# EAGLE schematic Soldering Iron V2 (EAGLE 9.3.1)
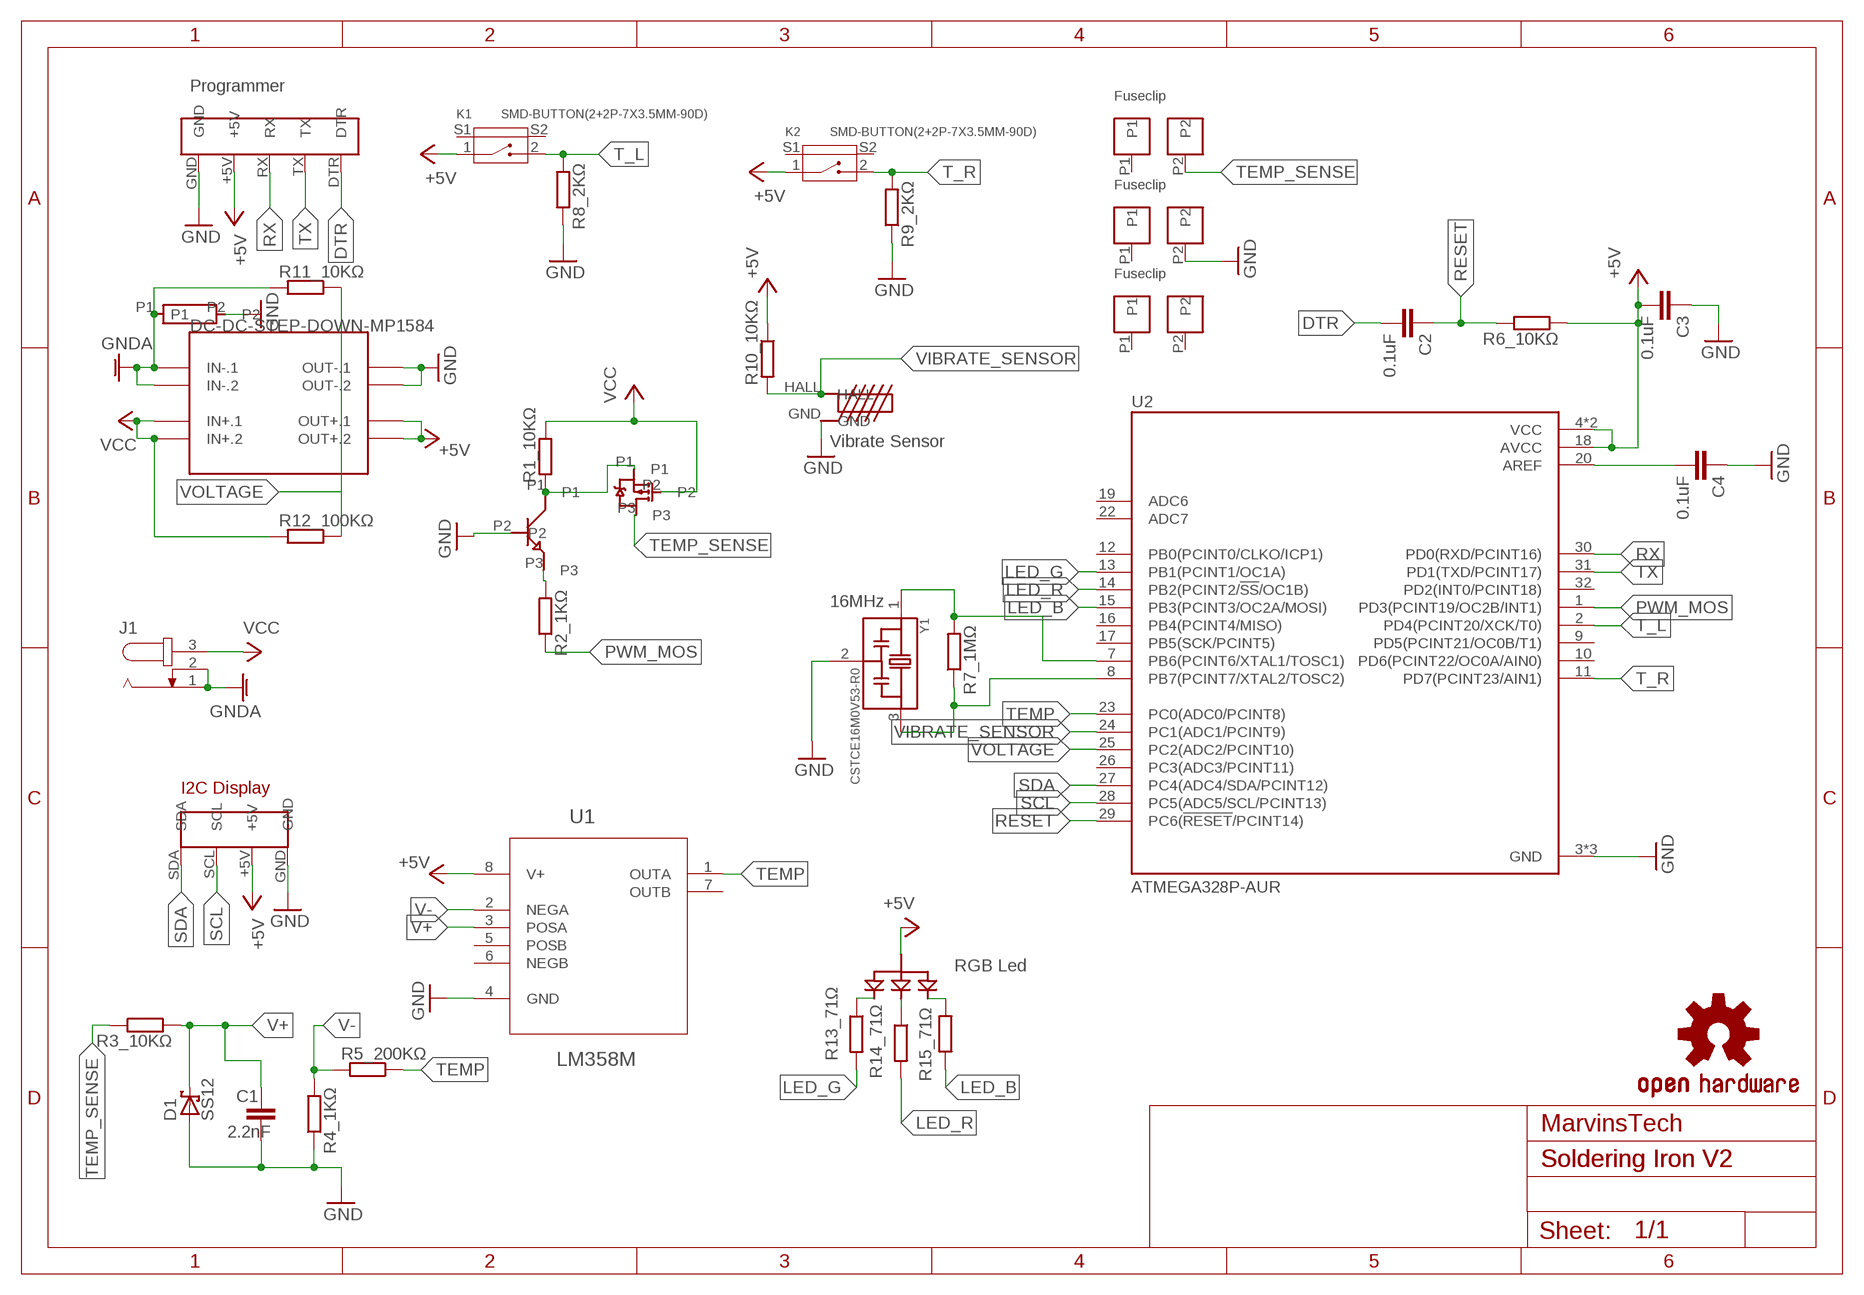
[diagram p0: schematic, sheet 1]

## Parts
C1  2.2nF  2.2NF/2200PF-0603-50V-10%  [0603]
C2  0.1uF  0.1UF-0603-25V-(+80/-20%)  [0603]
C3  0.1uF  0.1UF-0603-25V-(+80/-20%)  [0603]
C4  0.1uF  0.1UF-0603-25V-(+80/-20%)  [0603]
D1  SS12  [DO214AC]
J1  JACK-PLUG0  [SPC4077]
K1  SMD-BUTTON(2+2P-7X3.5MM-90D)  [SW4-SMD-7.0X3.5X3.5MM-90D]
K2  SMD-BUTTON(2+2P-7X3.5MM-90D)  [SW4-SMD-7.0X3.5X3.5MM-90D]
R1_10KΩ  SMK  [SMK]
R2_1KΩ  SMK  [SMK]
R3_10KΩ  SMK  [SMK]
R4_1KΩ  SMK  [SMK]
R5_200KΩ  SMK  [SMK]
R6_10KΩ  SMK  [SMK]
R7_1MΩ  SMK  [SMK]
R8_2KΩ  SMK  [SMK]
R9_2KΩ  SMK  [SMK]
R10_10KΩ  SMK  [SMK]
R11_10KΩ  SMK  [SMK]
R12_100KΩ  SMK  [SMK]
R13_71Ω  SMK  [SMK]
R14_71Ω  SMK  [SMK]
R15_71Ω  SMK  [SMK]
U1  LM358M  [SOIC127P620X175-8N]
U2  ATMEGA328P-AUR  [QFP80P900X900X120-32N]
U$1  DC-DC-STEP-DOWN-MP1584  [DC-DC-STEP-DOWN-MP1584]
U$2  IRF4905STRLPBF  [D2PAK-5]
U$3  2SC3356NPNBJT  [TO236]
U$4  I2C_DISPLAY  [I2C_DISPLAY]
U$5  VIBRATESENSOR  [VIBRATESENSOR]
U$6  FUSECLIPS  [FUSECLIP]
U$7  FUSECLIPS  [FUSECLIP]
U$8  FUSECLIPS  [FUSECLIP]
U$9  SHUNT_RESISTOR1  [RESISTOR1]
U$10  RGBLED  [RGBLED]
U$11  PROGRAMMER  [PROGRAMMER]
U$15  OSHW-LOGOS  [OSHW-LOGO-S]
Y1  CSTCE16M0V53-R0  [OSC_CSTCE16M0V53-R0]

## Nets
+5V: C3.2 K1.1 K2.1 R6_10KΩ.2 R10_10KΩ.1 U1.8(V+) U2.4(VCC) U2.6(VCC) U2.18(AVCC) U$1.OUT+.1 U$1.OUT+.2 U$4.+5V U$10.+5V U$11.+5V
DTR: C2.2 U$11.DTR
GND: C1.2 C3.1 C4.1 D1.A R4_1KΩ.1 R8_2KΩ.1 R9_2KΩ.1 U1.4(GND) U2.3(GND) U2.5(GND) U2.21(GND) U$1.OUT-.1 U$1.OUT-.2 U$3.P2 U$4.GND U$5.GND U$7.P2 U$9.P2 U$11.GND Y1.2
GNDA: J1.1 J1.2 R11_10KΩ.2 U$1.IN-.1 U$1.IN-.2 U$9.P1
LED_B: R15_71Ω.1 U2.15(PB3(PCINT3/OC2A/MOSI))
LED_G: R13_71Ω.2 U2.13(PB1(PCINT1/OC1A))
LED_R: R14_71Ω.2 U2.14(PB2(PCINT2/!SS!/OC1B))
N$1: R1_10KΩ.2 U$2.P1 U$3.P1
N$2: R2_1KΩ.2 U$3.P3
N$3: C4.2 U2.20(AREF)
N$4: R7_1MΩ.2 U2.7(PB6(PCINT6/XTAL1/TOSC1)) Y1.1
N$5: R7_1MΩ.1 U2.8(PB7(PCINT7/XTAL2/TOSC2)) Y1.3
N$6: R14_71Ω.1 U$10.P2
N$7: R13_71Ω.1 U$10.P3
N$8: R15_71Ω.2 U$10.P1
PWM_MOS: R2_1KΩ.1 U2.1(PD3(PCINT19/OC2B/INT1))
RESET: C2.1 R6_10KΩ.1 U2.29(PC6(!RESET!/PCINT14))
RX: U2.30(PD0(RXD/PCINT16)) U$11.RX
SCL: U2.28(PC5(ADC5/SCL/PCINT13)) U$4.SCL
SDA: U2.27(PC4(ADC4/SDA/PCINT12)) U$4.SDA
T_L: K1.2 R8_2KΩ.2 U2.2(PD4(PCINT20/XCK/T0))
T_R: K2.2 R9_2KΩ.2 U2.11(PD7(PCINT23/AIN1))
TEMP: R5_200KΩ.1 U1.1(OUTA) U2.23(PC0(ADC0/PCINT8))
TEMP_SENSE: R3_10KΩ.1 U$2.P3 U$6.P2
TX: U2.31(PD1(TXD/PCINT17)) U$11.TX
V+: C1.1 D1.C R3_10KΩ.2 U1.3(POSA)
V-: R4_1KΩ.2 R5_200KΩ.2 U1.2(NEGA)
VCC: J1.3 R1_10KΩ.1 R12_100KΩ.2 U$1.IN+.1 U$1.IN+.2 U$2.P2
VIBRATE_SENSOR: R10_10KΩ.2 U2.24(PC1(ADC1/PCINT9)) U$5.HALL
VOLTAGE: R11_10KΩ.1 R12_100KΩ.1 U2.25(PC2(ADC2/PCINT10))
Unconnected: K1.S1 K1.S2 K2.S1 K2.S2 U1.5(POSB) U1.6(NEGB) U1.7(OUTB) U2.9(PD5(PCINT21/OC0B/T1)) U2.10(PD6(PCINT22/OC0A/AIN0)) U2.12(PB0(PCINT0/CLKO/ICP1)) U2.16(PB4(PCINT4/MISO)) U2.17(PB5(SCK/PCINT5)) U2.19(ADC6) U2.22(ADC7) U2.26(PC3(ADC3/PCINT11)) U2.32(PD2(INT0/PCINT18)) U$6.P1 U$7.P1 U$8.P1 U$8.P2

## Notes on the sheet
- Programmer
- Vibrate Sensor
- 16MHz
- RGB Led
- MarvinsTech
- Soldering Iron V2

## Library data of the parts
C1 = SMD Cap:2.2NF/2200PF: 2.2nF/2,200pF ceramic capacitors A capacitor is a passive two-terminal electrical component used to store electrical energy temporarily in an electric field.; PROD_ID: CAP-07877
C2-C4 = SMD Cap:0.1UF: 0.1�F ceramic capacitors A capacitor is a passive two-terminal electrical component used to store electrical energy temporarily in an electric field.; PROD_ID: CAP-00810
D1 = SS12:SS12: http://octopart.com/ss12-tp-mcc-9293796; AVAILABILITY: Unavailable; DESCRIPTION: SS12 Series 500 mV 1 A 20 V Max Reverse Voltage Schottky Rectifier - DO-214AC; MF: Klein Tools,; MP: SS12; PACKAGE: DO-214AC-214 ON Semiconductor; PRICE: None
J1 = DC Power Jack:JACK-PLUG: DC POWER JACK Power Jack, DC, Right Angle, Through Hole, Rated 5A at 16VDC, PC Terminals Distributor: Farnell (www.Farnell.de) Drawing: 84N1161.pdf / 84N1162.pdf Manufacturer: SPC Technology (www.spctechnology.com) Type: SPC4077 / SPC 4078; OC_FARNELL: unknown; OC_NEWARK: unknown
K1 K2 = SMD-BUTTON_2_2P-7X3.5MM-90D_:SMD-BUTTON(2+2P-7X3.5MM-90D): 311020023; AVAILABILITY: Unavailable; MF: Best Inc.; MP: TS-1188E; PACKAGE: None; PRICE: None
R1_10KΩ R2_1KΩ R3_10KΩ R4_1KΩ R5_200KΩ R6_10KΩ R7_1MΩ R8_2KΩ R9_2KΩ R10_10KΩ R11_10KΩ R12_100KΩ R13_71Ω R14_71Ω R15_71Ω = resistor-shunt:SMK: SMD SHUNT RESISTOR
U1 = LM358M:LM358M: Low Power Dual Operational Amplifiers; AVAILABILITY: Unavailable; DESCRIPTION: 8 pin Low Power Dual Operational Amplifier 95 per tube; MF: ON Semiconductor; MP: LM358M; PACKAGE: SOIC-8 Texas Instruments; PRICE: None
U2 = ATMEGA328P-AUR:ATMEGA328P-AUR: ATmega328P Series 8 Bit 2 kB RAM 32 kB Flash SMT Microcontroller - TQFP-32; AVAILABILITY: Unavailable; DESCRIPTION: ATmega328P Series 8 Bit 2 kB RAM 32 kB Flash SMT Microcontroller - TQFP-32; MF: Microchip; MP: ATMEGA328P-AUR; PACKAGE: TQFP-32 Microchip; PRICE: None
U$1 = diy-modules:DC-DC-STEP-DOWN-MP1584: DC/DC Step-Down Regulator based on MP1584 chip MP1584 datasheet available here: http://www.haoyuelectronics.com/Attachment/MP1584/MP1584.pdf Click here to find device on ebay.com <http://www.ebay.com/sch/mp1584+module>
U$2 = D2PAK-5:IRF4905STRLPBF
U$3 = TO236:2SC3356NPNBJT
U$4 = Eigene Library:I2C_DISPLAY
U$5 = Eigene Library:VIBRATESENSOR
U$6-U$8 = Eigene Library:FUSECLIPS
U$9 = Eigene Library:SHUNT_RESISTOR1
U$10 = RGB LED:RGBLED
U$11 = Eigene Library:PROGRAMMER
U$15 = SparkFun:OSHW-LOGO: Open Source Hardware Logo This logo indicates the piece of hardware it is found on incorporates a OSHW license and/or adheres to the definition of open source hardware found here: http://freedomdefined.org/OSHW
Y1 = CSTCE16M0V53-R0:CSTCE16M0V53-R0: 16MHz Ceramic Resonator Built in Capacitor 15pF ±0.3% -20°C ~ 80°C Surface Mount; AVAILABILITY: Unavailable; DESCRIPTION: Ceramic Resonator 16MHz ??0.5% _Tol_ ??0.3% _Stability_ 15pF 40Ohm 3-Pin CSMD T/R; MF: Murata; MP: CSTCE16M0V53-R0; PACKAGE: SMD-3 Murata; PRICE: None

## Net classes
0 default: width 0.203 mm, drill 0.406 mm, clearance 0.203 mm